# Altium schematic sheet heater_control.SchDoc: Heater Control
size Tabloid; DocumentNumber: LM-003; Revision: 3.0; SheetNumber: 6; SheetTotal: 11
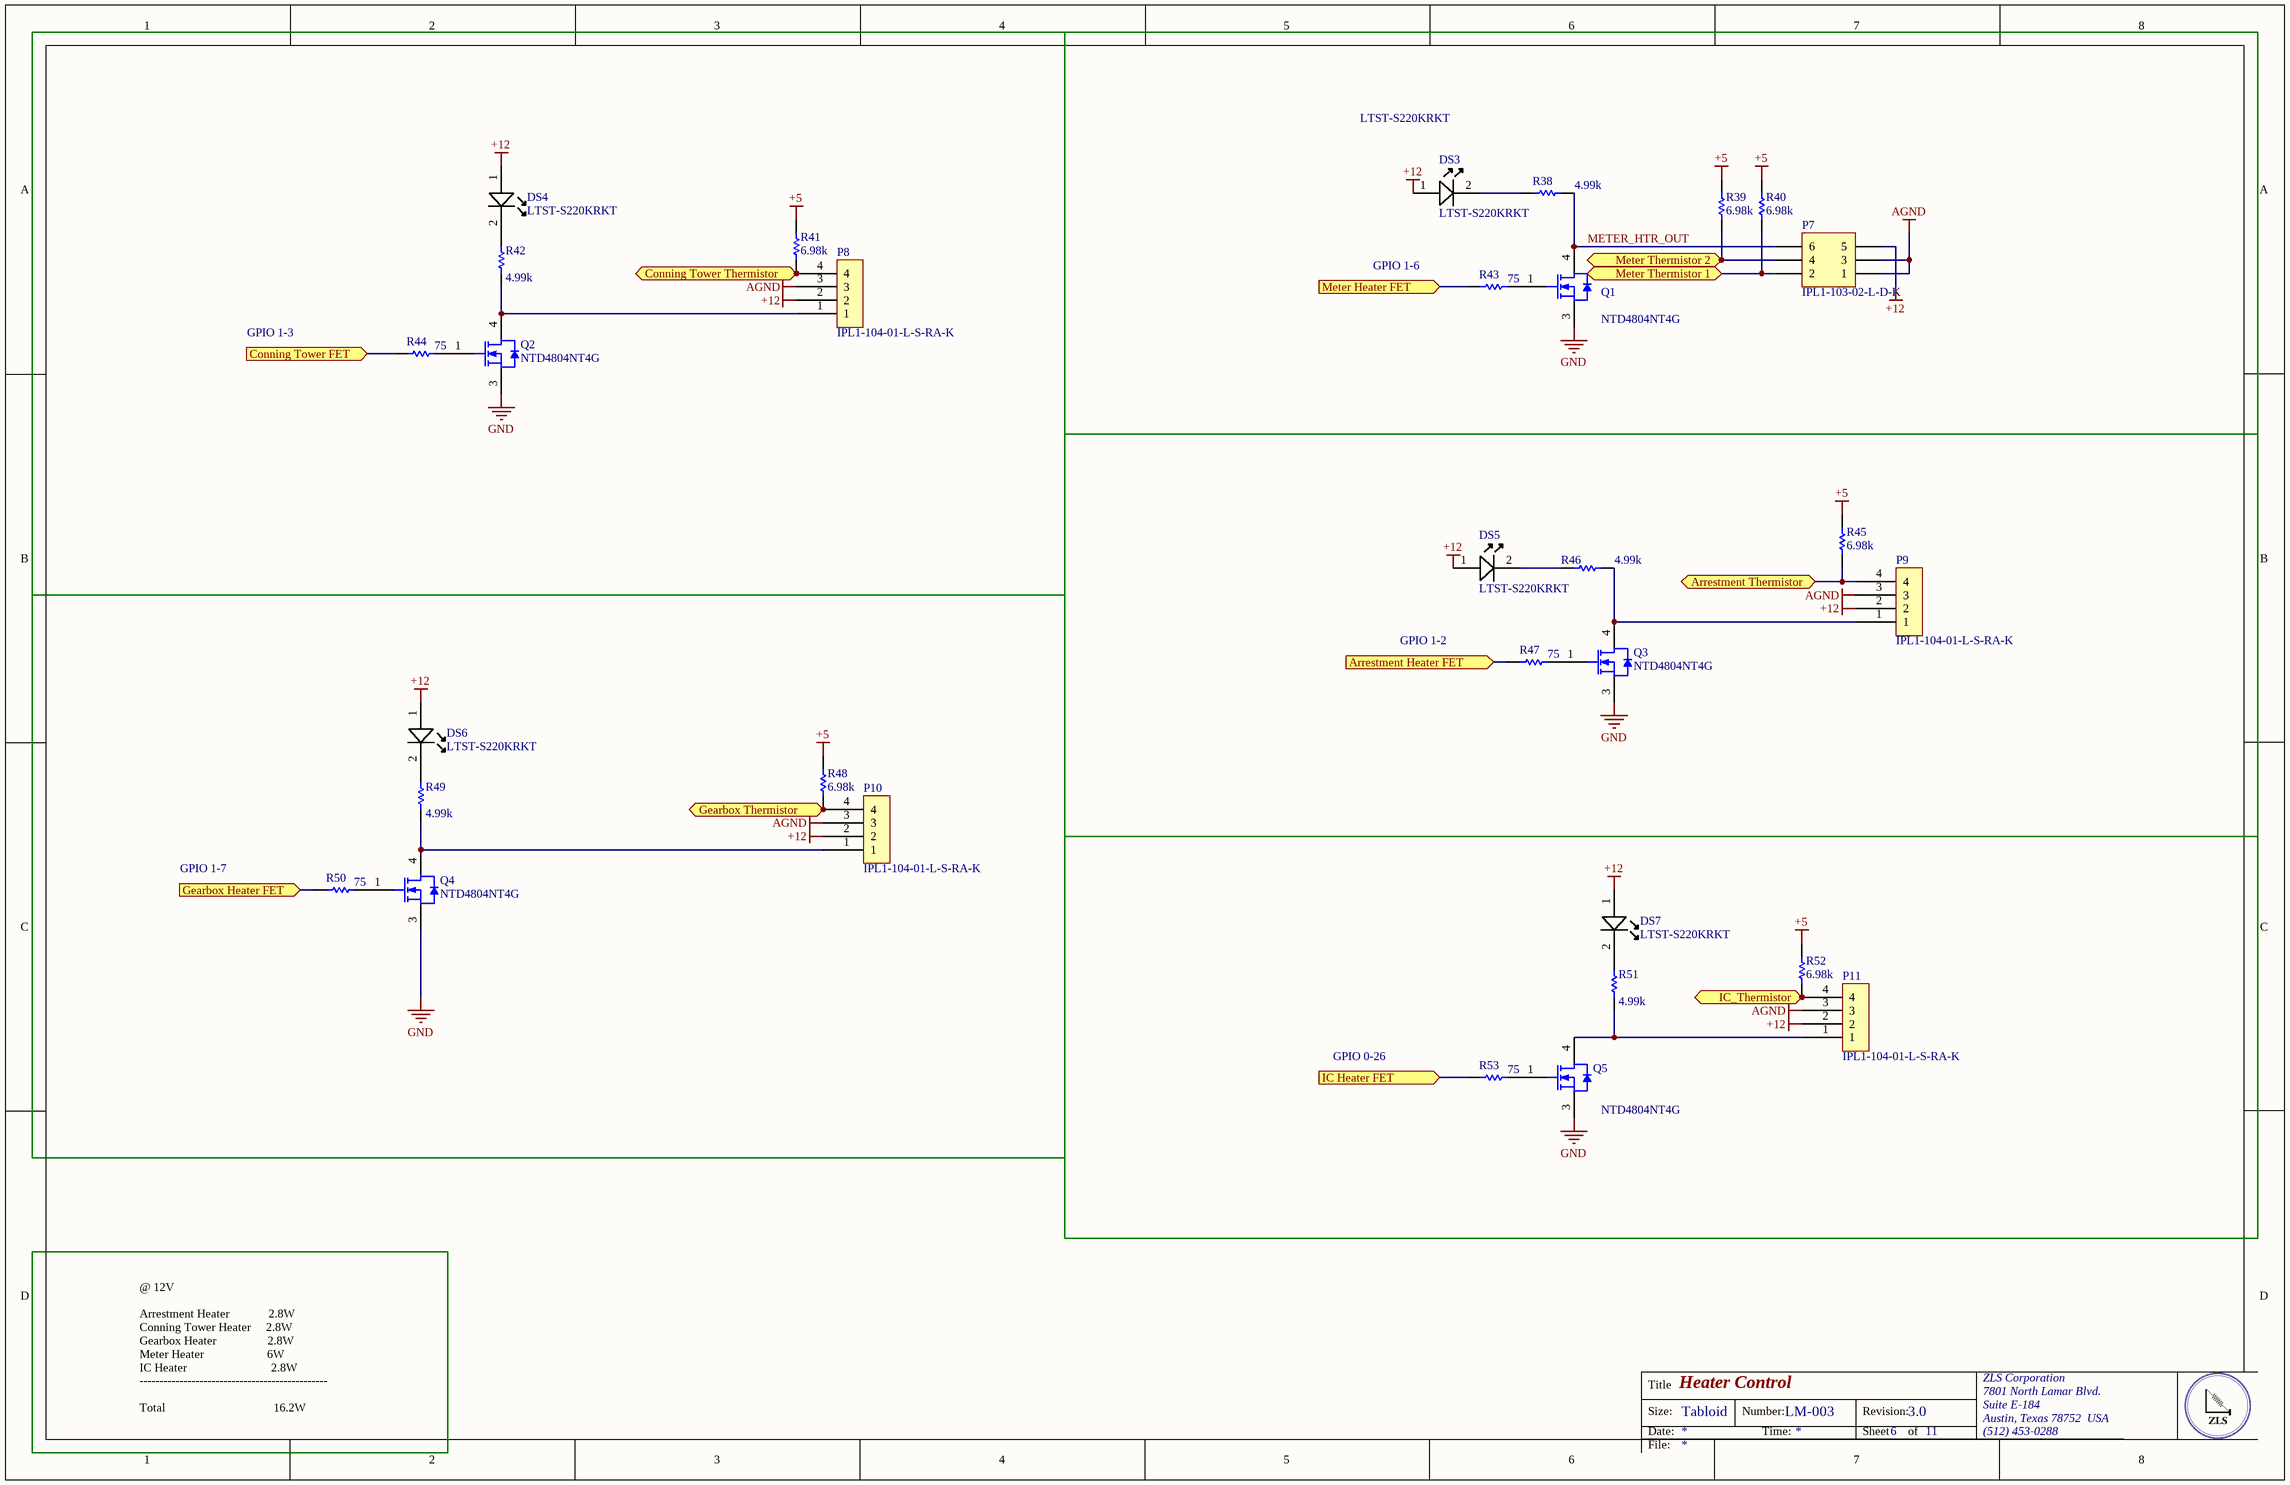
[diagram p0: heater_control.SchDoc]

## Parts
DS3  Manufacturer Part Number: LTST-S220KRKT  [0805C_L]  (hidden comment: Visible Name Value Type    False Description Lite-On LTST-S220KRKT Red LED, 631 nm 2012 (0805) Side View, Rectangle Lens SMD package STRING)
DS4  Manufacturer Part Number: LTST-S220KRKT  [0805C_L]  (hidden comment: Visible Name Value Type    False Description Lite-On LTST-S220KRKT Red LED, 631 nm 2012 (0805) Side View, Rectangle Lens SMD package STRING)
DS5  Manufacturer Part Number: LTST-S220KRKT  [0805C_L]  (hidden comment: Visible Name Value Type    False Description Lite-On LTST-S220KRKT Red LED, 631 nm 2012 (0805) Side View, Rectangle Lens SMD package STRING)
DS6  Manufacturer Part Number: LTST-S220KRKT  [0805C_L]  (hidden comment: Visible Name Value Type    False Description Lite-On LTST-S220KRKT Red LED, 631 nm 2012 (0805) Side View, Rectangle Lens SMD package STRING)
DS7  Manufacturer Part Number: LTST-S220KRKT  [0805C_L]  (hidden comment: Visible Name Value Type    False Description Lite-On LTST-S220KRKT Red LED, 631 nm 2012 (0805) Side View, Rectangle Lens SMD package STRING)
P7  IPL1-103-02-L-D-K  [IPL1-103-01-D]
P8  IPL1-104-01-L-S-RA-K  [IPL1-104-01]
P9  IPL1-104-01-L-S-RA-K  [IPL1-104-01]
P10  IPL1-104-01-L-S-RA-K  [IPL1-104-01]
P11  IPL1-104-01-L-S-RA-K  [IPL1-104-01]
Q1  NTD4804NT4G  [ONSC-DPAK-3-369AA-01_V]
Q2  NTD4804NT4G  [ONSC-DPAK-3-369AA-01_V]
Q3  NTD4804NT4G  [ONSC-DPAK-3-369AA-01_V]
Q4  NTD4804NT4G  [ONSC-DPAK-3-369AA-01_V]
Q5  NTD4804NT4G  [ONSC-DPAK-3-369AA-01_V]
R38  Resistance (Ohms): 4.99k  [RESC0805(2012)_L]
R39  Resistance (Ohms): 6.98k  [RESC0805(2012)_N]  (hidden comment: 6K98 1% 0805(2012))
R40  Resistance (Ohms): 6.98k  [RESC0805(2012)_N]  (hidden comment: 6K98 1% 0805(2012))
R41  Resistance (Ohms): 6.98k  [RESC0805(2012)_N]  (hidden comment: 6K98 1% 0805(2012))
R42  Resistance (Ohms): 4.99k  [RESC0805(2012)_L]
R43  Resistance (Ohms): 75  [RESC0805(2012)_L]
R44  Resistance (Ohms): 75  [RESC0805(2012)_L]
R45  Resistance (Ohms): 6.98k  [RESC0805(2012)_N]  (hidden comment: 6K98 1% 0805(2012))
R46  Resistance (Ohms): 4.99k  [RESC0805(2012)_L]
R47  Resistance (Ohms): 75  [RESC0805(2012)_L]
R48  Resistance (Ohms): 6.98k  [RESC0805(2012)_N]  (hidden comment: 6K98 1% 0805(2012))
R49  Resistance (Ohms): 4.99k  [RESC0805(2012)_L]
R50  Resistance (Ohms): 75  [RESC0805(2012)_L]
R51  Resistance (Ohms): 4.99k  [RESC0805(2012)_L]
R52  Resistance (Ohms): 6.98k  [RESC0805(2012)_N]  (hidden comment: 6K98 1% 0805(2012))
R53  Resistance (Ohms): 75  [RESC0805(2012)_L]

## Blocks framed on the sheet
GPIO 1-3: DS4 P8 Q2 R41 R42 R44
GPIO 1-2: DS5 P9 Q3 R45-R47
GPIO 1-7: DS6 P10 Q4 R48-R50
GPIO 0-26: DS7 P11 Q5 R51-R53

## Ports
Arrestment Heater FET (in), Arrestment Thermistor, Conning Tower FET (in), Conning Tower Thermistor (out), Gearbox Heater FET (in), Gearbox Thermistor (out), IC Heater FET (in), IC_Thermistor, Meter Heater FET (in), Meter Thermistor 1, Meter Thermistor 2

## Nets
+5: R39.1 R40.2 R41.2 R45.1 R48.2 R52.1
+12: DS3.1(A) DS4.1(A) DS5.1(A) DS6.1(A) DS7.1(A) P7.5 P8.2 P9.2 P10.2 P11.2
AGND: P7.1 P7.3 P8.3 P9.3 P10.3 P11.3
GND: Q1.3(S) Q2.3(S) Q3.3(S) Q4.3(S) Q5.3(S)
Arrestment Heater FET: R47.1 ; port Arrestment Heater FET
Arrestment Thermistor: P9.4 R45.2 ; port Arrestment Thermistor
Conning Tower FET: R44.1 ; port Conning Tower FET
Conning Tower Thermistor: P8.4 R41.1 ; port Conning Tower Thermistor
Gearbox Heater FET: R50.1 ; port Gearbox Heater FET
Gearbox Thermistor: P10.4 R48.1 ; port Gearbox Thermistor
IC Heater FET: R53.1 ; port IC Heater FET
IC_Thermistor: P11.4 R52.2 ; port IC_Thermistor
Meter Heater FET: R43.1 ; port Meter Heater FET
Meter Thermistor 1: P7.2 R40.1 ; port Meter Thermistor 1
Meter Thermistor 2: P7.4 R39.2 ; port Meter Thermistor 2
METER_HTR_OUT: P7.6 Q1.4(D) R38.2
NetDS3_2: DS3.2(K) R38.1
NetDS4_2: DS4.2(K) R42.2
NetDS5_2: DS5.2(K) R46.1
NetDS6_2: DS6.2(K) R49.2
NetDS7_2: DS7.2(K) R51.1
NetP8_1: P8.1 Q2.4(D) R42.1
NetP9_1: P9.1 Q3.4(D) R46.2
NetP10_1: P10.1 Q4.4(D) R49.1
NetP11_1: P11.1 Q5.4(D) R51.2
NetQ1_1: Q1.1(G) R43.2
NetQ2_1: Q2.1(G) R44.2
NetQ3_1: Q3.1(G) R47.2
NetQ4_1: Q4.1(G) R50.2
NetQ5_1: Q5.1(G) R53.2

## Notes on the sheet
- LTST-S220KRKT
- GPIO 1-6
- @ 12V
  Arrestment Heater             2.8W
  Conning Tower Heater     2.8W
  Gearbox Heater                 2.8W
  Meter Heater                     6W
  IC Heater                            2.8W
  -----------------------------------------------
  Total                                    16.2W
- Title
- Size:
- Date:
- Tabloid
- Number:
- Time:
- Revision:
- Sheet
- of
- ZLS Corporation
- 7801 North Lamar Blvd.
- Suite E-184
- Austin, Texas 78752  USA
- (512) 453-0288
- File:

## Library data of the parts
DS3-DS7 = LED A/K: Manufacturer: Vishay / Lite-On; Lens Colour: Colorless; Lens Style: Diffused,Colorless; Viewing Angle: 130°; Luminous Intensity: 54mcd; Forward Current: 20mA; Forward Voltage: 2V; Power Rating: 75mW; Dominant Wavelength: 631nm; Lens Transparency: Clear; Number of Elements: 1; Wavelength: 639nm; Supplier 1: Digi-Key; Supplier Part Number 1: 160-1469-1-ND; Stock 1: 108191; Pricing 1: 1=0.31, 10=0.225, 25=0.1656, 100=0.1183, 250=0.0804, 500=0.071, 1000=0.0556 (USD); Mount: Surface Mount; Case/Package: 0805; Number of Pins: 2; Colour: Red; Case Code (Metric): 2012; Case Code (Imperial): 0805; Min Operating Temperature: -55°C; Max Operating Temperature: 85°C; Packaging: Tape and Reel; Package Quantity: 4000; Illumination Colour: Red; Test Current: 20mA; Power Dissipation: 75mW; Number of LEDs: 1; Length: 2.1mm; Height: 0.6mm; Width: 1mm; Depth: 0.6mm; Radiation Hardening: No; Lead Free: Lead Free; ComponentLink1URL: https://datasheet.ciiva.com/2110/s-110-ltst-s220krkt-2110132.pdf; ComponentLink1Description: https://datasheet.ciiva.com/2110/s-110-ltst-s220krkt-2110132.pdf; ComponentLink2URL: https://datasheet.ciiva.com/2110/s-110-ltst-s220krkt-2110133.pdf; ComponentLink2Description: https://datasheet.ciiva.com/2110/s-110-ltst-s220krkt-2110133.pdf; ComponentLink3URL: https://datasheet.ciiva.com/2110/s-110-ltst-s220krkt-2110134.pdf; ComponentLink3Description: https://datasheet.ciiva.com/2110/s-110-ltst-s220krkt-2110134.pdf; ComponentLink4URL: https://datasheet.ciiva.com/12403/lite-on-ltst-s220krkt-187389-12403798.pdf; ComponentLink4Description: https://datasheet.ciiva.com/12403/lite-on-ltst-s220krkt-187389-12403798.pdf; ComponentLink5URL: https://datasheet.ciiva.com/16345/lite-onltst-s220krkt-16345511.pdf; ComponentLink5Description: https://datasheet.ciiva.com/16345/lite-onltst-s220krkt-16345511.pdf; ComponentLink6URL: https://datasheet.ciiva.com/15118/getdatasheetpartid-225752-15118120.pdf; ComponentLink6Description: https://datasheet.ciiva.com/15118/getdatasheetpartid-225752-15118120.pdf; ComponentLink7URL: https://datasheet.ciiva.com/14633/0900766b80dc0b76-14633737.pdf; ComponentLink7Description: https://datasheet.ciiva.com/14633/0900766b80dc0b76-14633737.pdf; ComponentLink8URL: https://datasheet.ciiva.com/11775/0900766b80dc0b76-11775439.pdf; ComponentLink8Description: https://datasheet.ciiva.com/11775/0900766b80dc0b76-11775439.pdf
P7 = Header 3X2H: CONN SHROUDED PWR HEADER 3POS; Manufacturer 1: Samtec Inc.; Category 1: Connectors, Interconnects; Pitch - Mating: 0.100" (2.54mm); Style: Board to Cable/Wire; Shrouding: Shrouded - 4 Wall; Number of Positions: 6; Number of Positions Loaded: All; Contact Length - Mating: 0.215" (5.46mm); Material Flammability Rating: UL94 V-0; Voltage Rating: 675VAC, 954VDC; Supplier 1: Digi-Key; Supplier Part Number 1: SAM10574-ND; Manufacturer Part Number 1: IPL1-103-02-L-D-K; RoHS 1: RoHS Compliant; Description 1: CONN SHROUDED PWR HEADER 3POS; Stock 1: 180; Pricing 1: 1=3.13, 10=3, 25=2.75, 50=2.625, 100=2.5, 250=2.18752, 500=2.125, 1000=1.8125, 2500=1.6875 (USD); Packaging: Tube; Part Status: Active; Connector Type: Header; Contact Type: Male Pin; Number of Rows: 2; Row Spacing - Mating: 0.100" (2.54mm); Mounting Type: Surface Mount; Termination: Solder; Fastening Type: Locking Ramp; Contact Length - Post: -; Overall Contact Length: -; Insulation Height: 0.320" (8.13mm); Contact Shape: Square; Contact Finish - Mating: Gold; Contact Finish Thickness - Mating: 10µin (0.25µm); Contact Finish - Post: Tin; Contact Material: Phosphor Bronze; Insulation Material: Liquid Crystal Polymer (LCP); Features: -; Operating Temperature: -55°C ~ 125°C; Ingress Protection: -; Insulation Color: Natural; Current Rating: -; Mated Stacking Heights: -; Contact Finish Thickness - Post: -; Applications: -; ComponentLink1URL: http://suddendocs.samtec.com/prints/ipl1-1xx-xx-xxx-d-xx-x-xx-mkt.pdf; ComponentLink1Description: http://suddendocs.samtec.com/prints/ipl1-1xx-xx-xxx-d-xx-x-xx-mkt.pdf
P8-P11 = 53047-0410: .100 TERMINAL ASSY; Manufacturer 1: Samtec Inc.; Category 1: Connectors, Interconnects; Connector Type: Header; Pitch - Mating: 0.100" (2.54mm); Style: Board to Cable/Wire; Shrouding: Shrouded - 4 Wall; Number of Positions: 4; Number of Positions Loaded: All; Contact Length - Mating: 0.215" (5.46mm); Contact Length - Post: 0.085" (2.16mm); Material Flammability Rating: UL94 V-0; Voltage Rating: 675VAC, 954VDC; Supplier 1: Digi-Key; Supplier Part Number 1: SAM9597-ND; Manufacturer Part Number 1: IPL1-104-01-L-S-RA-K; RoHS 1: RoHS Compliant; Description 1: .100 TERMINAL ASSY; Stock 1: 100; Pricing 1: 1=2.53, 10=2.424, 25=2.222, 50=2.121, 100=2.02, 250=1.76752, 500=1.717, 1000=1.4645, 2500=1.3635 (USD); Packaging: Tube; Part Status: Active; Contact Type: Male Pin; Number of Rows: 1; Row Spacing - Mating: -; Mounting Type: Through Hole, Right Angle; Termination: Solder; Fastening Type: Locking Ramp; Overall Contact Length: -; Insulation Height: 0.240" (6.10mm); Contact Shape: Square; Contact Finish - Mating: Gold; Contact Finish Thickness - Mating: 10µin (0.25µm); Contact Finish - Post: Tin; Contact Material: Phosphor Bronze; Insulation Material: Liquid Crystal Polymer (LCP); Features: -; Operating Temperature: -55°C ~ 125°C; Ingress Protection: -; Insulation Color: Natural; Current Rating: -; Mated Stacking Heights: -; Contact Finish Thickness - Post: -; Applications: -; ComponentLink1URL: http://suddendocs.samtec.com/prints/ipl1-1xx-xx-xxx-s-xx-x-xx-mkt.pdf; ComponentLink1Description: http://suddendocs.samtec.com/prints/ipl1-1xx-xx-xxx-s-xx-x-xx-mkt.pdf
Q1-Q5 = CMP-1058-00341-1: Power MOSFET, 30 V, 117 A, Single N-Channel, 3-Pin DPAK, Pb-Free, Tape and Reel; Manufacturer: On Semiconductor; Coss Typ (pF): 952; Qrr Typ (nC): 30; VGS Max (V): 20; ID Max (A): 117; Crss Typ (pF): 556; Channel Polarity: N Channel; Ciss Typ (pF): 4490; VGS(th) Max (V): 2.5; ComponentLink2Description: Datasheet; ComponentLink3Description: Package Specification; Mounting Technology: Surface Mount; PackageDescription: 3-Pin Flange Mount, Body 6.54 x 6.095 mm, Pitch 2.29 mm; PackageVersion: Rev. B, 06/2010; PartNumber: NTD4804NT4G; ComponentLink2URL: http://www.onsemi.cn/pub_link/Collateral/NTD4804N-D.PDF; RoHS: Pb-Free; Configuration: Single; DatasheetVersion: Rev. 8; PackageReference: DPAK-3-369AA-01; ComponentLink3URL: http://www.onsemi.cn/pub_link/Collateral/369AA.PDF; ComponentLink1Description: Manufacturer URL; Packing: Tape and Reel; Package Type: DPAK-3; ComponentLink1URL: http://www.onsemi.com/; V(BR)DSS Min (V): 30; Supplier 1: Digi-Key; Supplier Part Number 1: NTD4804NT4GOSDKR-ND
R38 R42 R46 R49 R51 = CMP-1013-00393-1: Manufacturer: Vishay Dale; Manufacturer Part Number: CRCW08054K99FKEA; Tolerance: ±1%; Power (Watts): 0.125W, 1/8W; Temperature Coefficient: ±100ppm/°C; Supplier 1: Digi-Key; Supplier Part Number 1: 541-4.99KCCT-ND; RoHS: RoHS Compliant; Category: Resistors; Stock 1: 93740; Pricing 1: 1=0.1, 10=0.044, 100=0.0178, 1000=0.00802, 2500=0.00696 (USD); Packaging: Cut Tape (CT); Part Status: Active; Composition: Thick Film; Features: Automotive AEC-Q200; Operating Temperature: -55°C ~ 155°C; Package / Case: 0805 (2012 Metric); Supplier Device Package: 0805; Size / Dimension: 0.079" L x 0.049" W (2.00mm x 1.25mm); Height - Seated (Max): 0.020" (0.50mm); Failure Rate: -; ComponentLink1URL: http://www.vishay.com/docs/20035/dcrcwe3.pdf; ComponentLink1Description: http://www.vishay.com/docs/20035/dcrcwe3.pdf
R39-R41 R45 R48 R52 = CMP-1013-00606-1: 6K98 0.125W 1% 0805 (2012 Metric)  SMD; Manufacturer: Vishay Dale; Manufacturer Part Number: CRCW08056K98FKEA; Power (Watts): 0.125W, 1/8W; Temperature Coefficient: ±100ppm/°C; Supplier 1: Digi-Key; Supplier Part Number 1: 541-6.98KCCT-ND; RoHS: RoHS Compliant; Category: Resistors; Stock 1: 34245; Pricing 1: 1=0.1, 10=0.044, 100=0.0178, 1000=0.00802, 2500=0.00696 (USD); Packaging: Cut Tape (CT); Part Status: Active; Tolerance: ±1%; Composition: Thick Film; Features: Automotive AEC-Q200; Operating Temperature: -55°C ~ 155°C; Package / Case: 0805 (2012 Metric); Supplier Device Package: 0805; Size / Dimension: 0.079" L x 0.049" W (2.00mm x 1.25mm); Height - Seated (Max): 0.020" (0.50mm); Failure Rate: -; ComponentLink1URL: http://www.vishay.com/docs/20035/dcrcwe3.pdf; ComponentLink1Description: http://www.vishay.com/docs/20035/dcrcwe3.pdf
R43 R44 R47 R50 R53 = CMP-1013-00393-1: Manufacturer: Vishay Dale; Manufacturer Part Number: CRCW080575R0FKEA; Tolerance: ±1%; Power (Watts): 0.125W, 1/8W; Temperature Coefficient: ±100ppm/°C; Supplier 1: Digi-Key; Supplier Part Number 1: 541-75.0CCT-ND; RoHS: RoHS Compliant; Category: Resistors; Stock 1: 32546; Pricing 1: 1=0.1, 10=0.044, 100=0.0178, 1000=0.00802, 2500=0.00696 (USD); Packaging: Cut Tape (CT); Part Status: Active; Composition: Thick Film; Features: Automotive AEC-Q200; Operating Temperature: -55°C ~ 155°C; Package / Case: 0805 (2012 Metric); Supplier Device Package: 0805; Size / Dimension: 0.079" L x 0.049" W (2.00mm x 1.25mm); Height - Seated (Max): 0.020" (0.50mm); Failure Rate: -; ComponentLink1URL: http://www.vishay.com/docs/20035/dcrcwe3.pdf; ComponentLink1Description: http://www.vishay.com/docs/20035/dcrcwe3.pdf